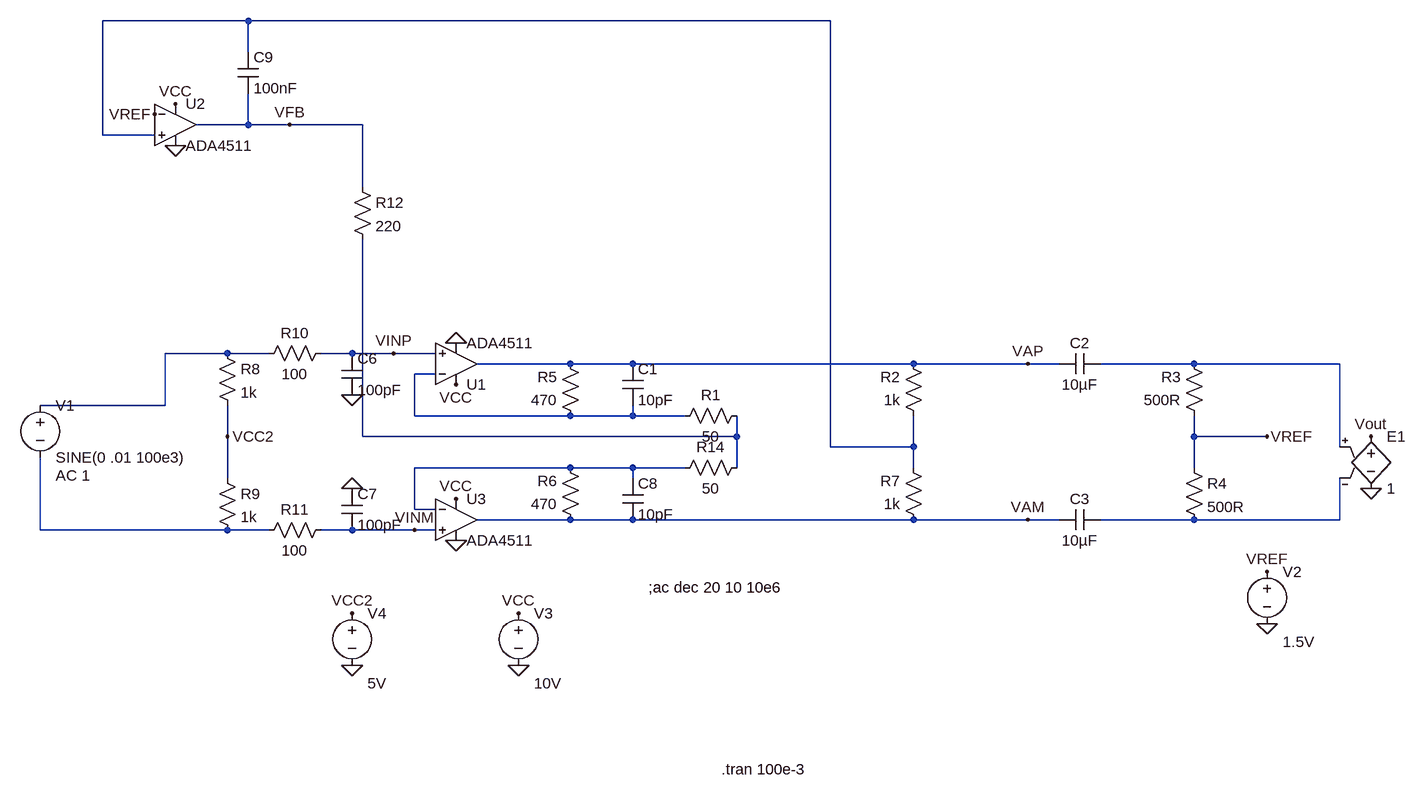
[diagram p0: schematic RX sim rev F.asc]
RX sim rev F.asc, the LTspice schematic file:
Version 4
SHEET 1 1036 860
WIRE -752 -384 -976 -384
WIRE 144 -384 -752 -384
WIRE -752 -336 -752 -384
WIRE -752 -224 -752 -272
WIRE -752 -224 -832 -224
WIRE -688 -224 -752 -224
WIRE -576 -224 -688 -224
WIRE -976 -208 -976 -384
WIRE -896 -208 -976 -208
WIRE -576 -128 -576 -224
WIRE -784 128 -880 128
WIRE -720 128 -784 128
WIRE -592 128 -640 128
WIRE -528 128 -592 128
WIRE -464 128 -528 128
WIRE -256 144 -400 144
WIRE -160 144 -256 144
WIRE 272 144 -160 144
WIRE 448 144 272 144
WIRE 496 144 448 144
WIRE 704 144 560 144
WIRE 928 144 704 144
WIRE -464 160 -496 160
WIRE -880 208 -880 128
WIRE -880 208 -1072 208
WIRE -496 224 -496 160
WIRE -256 224 -496 224
WIRE -160 224 -160 208
WIRE -160 224 -256 224
WIRE -80 224 -160 224
WIRE -784 256 -784 208
WIRE -576 256 -576 -48
WIRE 0 256 0 224
WIRE 0 256 -576 256
WIRE 704 256 704 224
WIRE 816 256 704 256
WIRE 144 272 144 -384
WIRE 272 272 272 224
WIRE 272 272 144 272
WIRE 928 272 928 144
WIRE -256 304 -496 304
WIRE -160 304 -256 304
WIRE -80 304 -160 304
WIRE 0 304 0 256
WIRE 272 304 272 272
WIRE 704 304 704 256
WIRE -784 320 -784 256
WIRE -160 320 -160 304
WIRE -496 368 -496 304
WIRE -464 368 -496 368
WIRE -256 384 -400 384
WIRE -160 384 -256 384
WIRE 272 384 -160 384
WIRE 448 384 272 384
WIRE 496 384 448 384
WIRE 704 384 560 384
WIRE 928 384 928 320
WIRE 928 384 704 384
WIRE -1072 400 -1072 288
WIRE -784 400 -1072 400
WIRE -720 400 -784 400
WIRE -592 400 -640 400
WIRE -496 400 -592 400
WIRE -464 400 -496 400
FLAG 976 336 0
FLAG 976 256 Vout
FLAG 816 544 0
FLAG -432 112 0
FLAG -432 416 0
FLAG 816 256 VREF
FLAG 816 464 VREF
FLAG -432 176 VCC
FLAG -432 352 VCC
FLAG -336 608 0
FLAG -336 528 VCC
FLAG -784 256 VCC2
FLAG -592 192 0
FLAG -592 336 0
FLAG -592 608 0
FLAG -592 528 VCC2
FLAG 448 384 VAM
FLAG 448 144 VAP
FLAG -864 -256 VCC
FLAG -864 -192 0
FLAG -896 -240 VREF
FLAG -528 128 VINP
FLAG -496 400 VINM
FLAG -688 -224 VFB
SYMBOL res 720 240 R180
WINDOW 0 36 76 Left 2
WINDOW 3 36 40 Left 2
SYMATTR InstName R3
SYMATTR Value 500R
SYMBOL res 688 288 R0
SYMATTR InstName R4
SYMATTR Value 500R
SYMBOL cap 560 128 R90
WINDOW 0 0 32 VBottom 2
WINDOW 3 32 32 VTop 2
SYMATTR InstName C2
SYMATTR Value 10µF
SYMBOL cap 560 368 R90
WINDOW 0 0 32 VBottom 2
WINDOW 3 32 32 VTop 2
SYMATTR InstName C3
SYMATTR Value 10µF
SYMBOL voltage -1072 192 R0
WINDOW 123 24 124 Left 2
WINDOW 39 0 0 Left 0
SYMATTR InstName V1
SYMATTR Value SINE(0 .01 100e3)
SYMATTR Value2 AC 1
SYMBOL res -240 240 R180
WINDOW 0 36 76 Left 2
WINDOW 3 36 40 Left 2
SYMATTR InstName R5
SYMATTR Value 470
SYMBOL res -240 400 R180
WINDOW 0 36 76 Left 2
WINDOW 3 36 40 Left 2
SYMATTR InstName R6
SYMATTR Value 470
SYMBOL e 976 240 R0
SYMATTR InstName E1
SYMATTR Value 1
SYMBOL voltage 816 448 R0
WINDOW 123 24 124 Left 2
WINDOW 39 0 0 Left 0
SYMATTR InstName V2
SYMATTR Value ""
SYMATTR Value2 1.5V
SYMBOL voltage -336 512 R0
WINDOW 123 24 124 Left 2
WINDOW 39 0 0 Left 0
SYMATTR InstName V3
SYMATTR Value ""
SYMATTR Value2 10V
SYMBOL res -800 112 R0
SYMATTR InstName R8
SYMATTR Value 1k
SYMBOL res -800 304 R0
SYMATTR InstName R9
SYMATTR Value 1k
SYMBOL cap -608 128 R0
SYMATTR InstName C6
SYMATTR Value 100pF
SYMBOL cap -608 336 R0
SYMATTR InstName C7
SYMATTR Value 100pF
SYMBOL res -624 112 R90
WINDOW 0 0 56 VBottom 2
WINDOW 3 32 56 VTop 2
SYMATTR InstName R10
SYMATTR Value 100
SYMBOL res -624 384 R90
WINDOW 0 0 56 VBottom 2
WINDOW 3 32 56 VTop 2
SYMATTR InstName R11
SYMATTR Value 100
SYMBOL cap -176 144 R0
SYMATTR InstName C1
SYMATTR Value 10pF
SYMBOL cap -176 320 R0
SYMATTR InstName C8
SYMATTR Value 10pF
SYMBOL voltage -592 512 R0
WINDOW 123 24 124 Left 2
WINDOW 39 0 0 Left 0
SYMATTR InstName V4
SYMATTR Value ""
SYMATTR Value2 5V
SYMBOL res -96 240 R270
WINDOW 0 32 56 VTop 2
WINDOW 3 0 56 VBottom 2
SYMATTR InstName R1
SYMATTR Value 50
SYMBOL OpAmps\\ADA4511 -864 -288 R0
SYMATTR InstName U2
SYMBOL res 288 240 R180
WINDOW 0 36 76 Left 2
WINDOW 3 36 40 Left 2
SYMATTR InstName R2
SYMATTR Value 1k
SYMBOL res 288 400 R180
WINDOW 0 36 76 Left 2
WINDOW 3 36 40 Left 2
SYMATTR InstName R7
SYMATTR Value 1k
SYMBOL res -592 -144 R0
SYMATTR InstName R12
SYMATTR Value 220
SYMBOL cap -768 -336 R0
SYMATTR InstName C9
SYMATTR Value 100nF
SYMBOL res -96 320 R270
WINDOW 0 32 56 VTop 2
WINDOW 3 0 56 VBottom 2
SYMATTR InstName R14
SYMATTR Value 50
SYMBOL OpAmps\\ADA4511 -432 208 M180
SYMATTR InstName U1
SYMBOL OpAmps\\ADA4511 -432 320 R0
SYMATTR InstName U3
TEXT -136 488 Left 2 !;ac dec 20 10 10e6
TEXT -24 768 Left 2 !.tran 100e-3

The netlist it stands for:
* RX sim rev F.asc
R3 VREF N003 500R
R4 VREF N007 500R
C2 N003 VAP 10µF
C3 N007 VAM 10µF
V1 N002 N008 SINE(0 .01 100e3) AC 1
R5 N004 VAP 470
R6 VAM N006 470
E1 Vout 0 N003 N007 1
V2 VREF 0 1.5V
V3 VCC 0 10V
R8 N002 VCC2 1k
R9 VCC2 N008 1k
C6 VINP 0 100pF
C7 0 VINM 100pF
R10 VINP N002 100
R11 VINM N008 100
C1 VAP N004 10pF
C8 N006 VAM 10pF
V4 VCC2 0 5V
R1 N004 N005 50
XU2 N001 VREF VCC 0 VFB ADA4511  ; pins In+ In- V+ V- OUT
R2 N001 VAP 1k
R7 VAM N001 1k
R12 VFB N005 220
C9 N001 VFB 100nF
R14 N006 N005 50
XU1 VINP N004 VCC 0 VAP ADA4511  ; pins In+ In- V+ V- OUT
XU3 VINM N006 VCC 0 VAM ADA4511  ; pins In+ In- V+ V- OUT
;ac dec 20 10 10e6
.tran 100e-3
.backanno
.end